# EAGLE design 4ButtonSwitch.Rev4.0 (EAGLE 8.6.0)
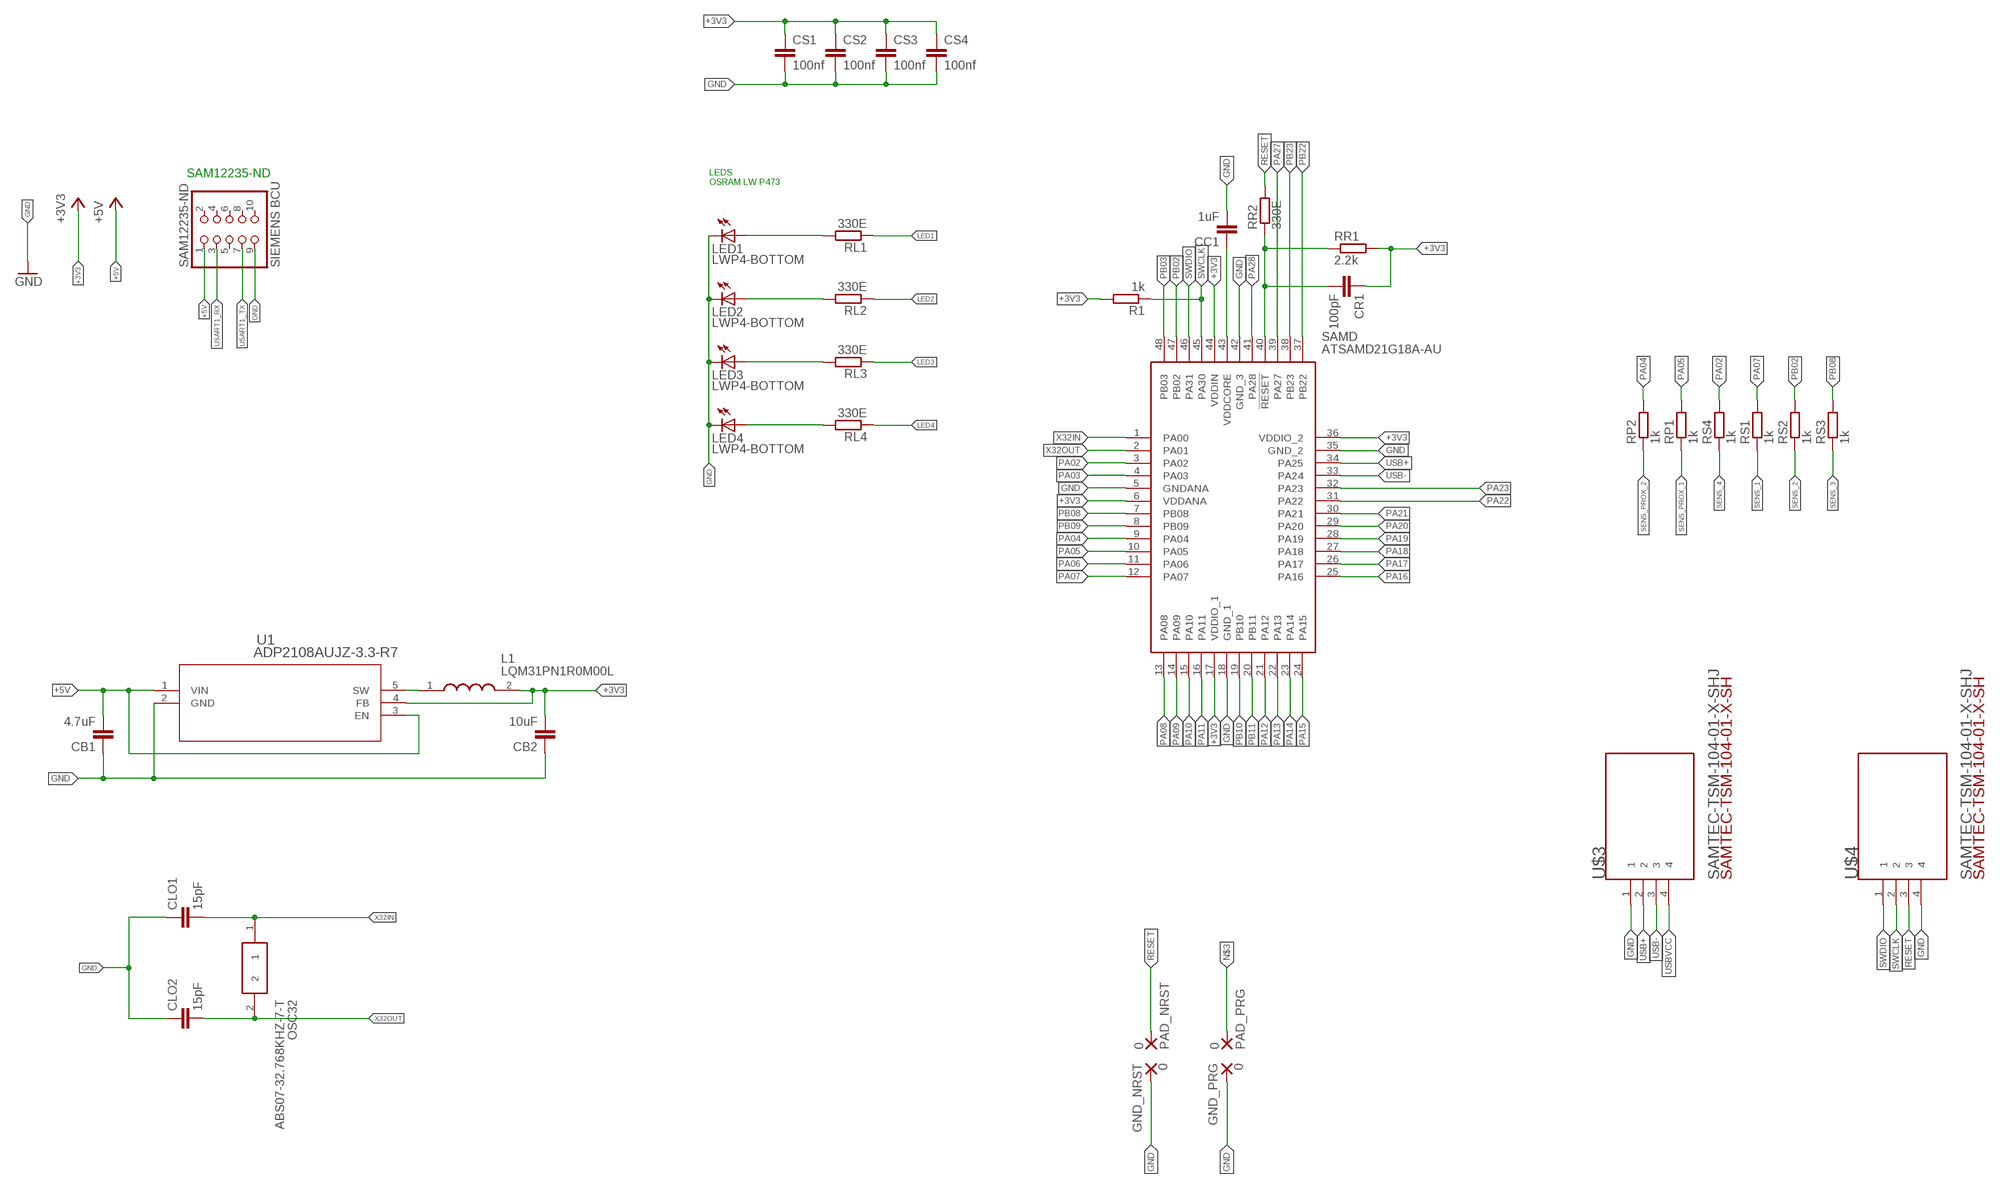
[diagram p0: schematic, sheet 1]

## Parts
CB1  4.7uF  C-EUC1206  [C1206]
CB2  10uF  C-EUC1206  [C1206]
CC1  1uF  C-EUC1206  [C1206]
CLO1  15pF  C-EUC1206  [C1206]
CLO2  15pF  C-EUC1206  [C1206]
CR1  100pF  C-EUC1206  [C1206]
CS1  100nf  C-EUC1206  [C1206]
CS2  100nf  C-EUC1206  [C1206]
CS3  100nf  C-EUC1206  [C1206]
CS4  100nf  C-EUC1206  [C1206]
GND_NRST  0  SMD5  [SMD2,54-5,08]
GND_PRG  0  SMD5  [SMD2,54-5,08]
L1  LQM31PN1R0M00L  [INDC3216X95N]
LED1  LWP4-BOTTOM  [P47F-BOTTOM]
LED2  LWP4-BOTTOM  [P47F-BOTTOM]
LED3  LWP4-BOTTOM  [P47F-BOTTOM]
LED4  LWP4-BOTTOM  [P47F-BOTTOM]
OSC32  ABS07-32.768KHZ-7-T  [ABS-07]
PAD_NRST  0  SMD5  [SMD2,54-5,08]
PAD_PRG  0  SMD5  [SMD2,54-5,08]
R1  1k  R-EU_R1206  [R1206]
RL1  330E  R-EU_R1206  [R1206]
RL2  330E  R-EU_R1206  [R1206]
RL3  330E  R-EU_R1206  [R1206]
RL4  330E  R-EU_R1206  [R1206]
RP1  1k  R-EU_R1206  [R1206]
RP2  1k  R-EU_R1206  [R1206]
RR1  2.2k  R-EU_R1206  [R1206]
RR2  330E  R-EU_R1206  [R1206]
RS1  1k  R-EU_R1206  [R1206]
RS2  1k  R-EU_R1206  [R1206]
RS3  1k  R-EU_R1206  [R1206]
RS4  1k  R-EU_R1206  [R1206]
SAM12235-ND  SIEMENS BCU  PINHD-2X5_2.54-SMD  [2X05SMD]
SAMD  ATSAMD21G18A-AU  [QFP50P900X900X120-48N]
U1  ADP2108AUJZ-3.3-R7  [UJ_5]
U$3  SAMTEC-TSM-104-01-X-SHJ  [SAMTEC-TSM-104-01-X-SH]
U$4  SAMTEC-TSM-104-01-X-SHJ  [SAMTEC-TSM-104-01-X-SH]

## Nets
+3V3: CB2.2 CR1.1 CS1.1 CS2.1 CS3.1 CS4.1 L1.2 R1.2 RR1.2 SAMD.6(VDDANA) SAMD.17(VDDIO_1) SAMD.36(VDDIO_2) SAMD.44(VDDIN) U1.4(FB)
+5V: CB1.2 SAM12235-ND.1 U1.1(VIN) U1.3(EN)
GND: CB1.1 CB2.1 CC1.2 CLO1.1 CLO2.1 CS1.2 CS2.2 CS3.2 CS4.2 GND_NRST.1(P) GND_PRG.1(P) LED1.C LED2.C LED3.C LED4.C SAM12235-ND.9 SAMD.5(GNDANA) SAMD.18(GND_1) SAMD.35(GND_2) SAMD.42(GND_3) U1.2(GND) U$3.1 U$4.4
LED1: RL1.1
LED2: RL2.1
LED3: RL3.1
LED4: RL4.1
N$2: L1.1 U1.5(SW)
N$3: PAD_PRG.1(P)
N$19: LED1.A RL1.2
N$20: LED2.A RL2.2
N$21: LED3.A RL3.2
N$22: LED4.A RL4.2
NRST: CR1.2 RR1.1 RR2.1 SAMD.40(!RESET)
PA02: RS4.2 SAMD.3(PA02)
PA03: SAMD.4(PA03)
PA04: RP2.2 SAMD.9(PA04)
PA05: RP1.2 SAMD.10(PA05)
PA06: SAMD.11(PA06)
PA07: RS1.2 SAMD.12(PA07)
PA08: SAMD.13(PA08)
PA09: SAMD.14(PA09)
PA10: SAMD.15(PA10)
PA11: SAMD.16(PA11)
PA12: SAMD.21(PA12)
PA13: SAMD.22(PA13)
PA14: SAMD.23(PA14)
PA15: SAMD.24(PA15)
PA16: SAMD.25(PA16)
PA17: SAMD.26(PA17)
PA18: SAMD.27(PA18)
PA19: SAMD.28(PA19)
PA20: SAMD.29(PA20)
PA21: SAMD.30(PA21)
PA22: SAMD.31(PA22)
PA23: SAMD.32(PA23)
PA27: SAMD.39(PA27)
PA28: SAMD.41(PA28)
PB02: RS2.2 SAMD.47(PB02)
PB03: SAMD.48(PB03)
PB08: RS3.2 SAMD.7(PB08)
PB09: SAMD.8(PB09)
PB10: SAMD.19(PB10)
PB11: SAMD.20(PB11)
PB22: SAMD.37(PB22)
PB23: SAMD.38(PB23)
RESET: PAD_NRST.1(P) RR2.2 U$4.3
SENS_1: RS1.1
SENS_2: RS2.1
SENS_3: RS3.1
SENS_4: RS4.1
SENS_PROX_1: RP1.1
SENS_PROX_2: RP2.1
SWCLK: R1.1 SAMD.45(PA30) U$4.2
SWDIO: SAMD.46(PA31) U$4.1
USART1_RX: SAM12235-ND.3
USART1_TX: SAM12235-ND.7
USB+: SAMD.34(PA25) U$3.2
USB-: SAMD.33(PA24) U$3.3
USBVCC: U$3.4
VDDCORE: CC1.1 SAMD.43(VDDCORE)
X32IN: CLO1.2 OSC32.1 SAMD.1(PA00)
X32OUT: CLO2.2 OSC32.2 SAMD.2(PA01)
Unconnected: SAM12235-ND.2 SAM12235-ND.4 SAM12235-ND.5 SAM12235-ND.6 SAM12235-ND.8 SAM12235-ND.10

## Notes on the sheet
- SAM12235-ND
- LEDS
  OSRAM LW P473

## Library data of the parts
CB1 CB2 CC1 CLO1 CLO2 CR1 CS1-CS4 = rcl:C-EU: CAPACITOR, European symbol; SPICEPREFIX: C
GND_NRST GND_PRG PAD_NRST PAD_PRG = wirepad:SMD5: SMD PAD
L1 = LQM31PN1R0M00L:LQM31PN1R0M00L: Murata LQM31P_00 Series 1000 nH 20% Ferrite Multilayer SMD Inductor, 1206 Case, SRF: 0.06GHz 1200mA dc 150m Rdc Source: Datasheet <http://docs-europe.electrocomponents.com/webdocs/1256/0900766b812561f7.pdf>; ARROW_PART_NUMBER: LQM31PN1R0M00L; ARROW_PRICE-STOCK: http://uk.rs-online.com/web/p/products/1674189; DESCRIPTION: Murata LQM31P_00 Series 1000 nH 20% Ferrite Multilayer SMD Inductor, 1206 Case, SRF: 0.06GHz 1200mA dc 150m Rdc; HEIGHT: 0.95mm; MANUFACTURER_NAME: Murata Electronics; MANUFACTURER_PART_NUMBER: LQM31PN1R0M00L; RS_PART_NUMBER: 1674189; RS_PRICE-STOCK: http://uk.rs-online.com/web/p/products/1674189
LED1-LED4 = led:*P4: PointLED® Enhanced Thinfilm LED TOP & BOTTOM mount LS P47F, LR P47F, LA P47F, LY P47F, LT P4SG, LB P4SG, LW P4SG Source: http://catalog.osram-os.com .. LA_LR_LS_LY_P47F_Pb_free.pdf
OSC32 = ABS07-32.768KHZ-7-T:ABS07-32.768KHZ-7-T: ABRACON - ABS07-32.768KHZ-7-T - CRYSTAL, 32.768KHZ, 7PF, SMD Source: Datasheet <https://componentsearchengine.com/Datasheets/2/ABS07-32.768KHZ-7-T.pdf>; ARROW_PART_NUMBER: ABS07-32.768KHZ-7-T; ARROW_PRICE/STOCK: https://www.arrow.com/en/products/abs07-32.768khz-7-t/abracon; DESCRIPTION: ABRACON - ABS07-32.768KHZ-7-T - CRYSTAL, 32.768KHZ, 7PF, SMD; HEIGHT: mm; MANUFACTURER_NAME: ABRACON; MANUFACTURER_PART_NUMBER: ABS07-32.768KHZ-7-T; RS_PART_NUMBER: 1712773P; RS_PRICE/STOCK: http://uk.rs-online.com/web/p/products/1712773P
R1 RL1-RL4 RP1 RP2 RR1 RR2 RS1-RS4 = resistor:R-EU_: RESISTOR, European symbol
SAM12235-ND = pinhead:PINHD-2X5: PIN HEADER
SAMD = ATSAMD21G18A-AU:ATSAMD21G18A-AU: ATMEL - ATSAMD21G18A-AU - MCU, 32BIT, CORTEX-M0+, 48MHZ, TQFP-48 Source: Datasheet <http://www.farnell.com/datasheets/1807566.pdf>; ARROW_PART_NUMBER: ATSAMD21G18A-AU; ARROW_PRICE-STOCK: https://www.arrow.com/en/products/atsamd21g18a-au/microchip-technology; DESCRIPTION: ATMEL - ATSAMD21G18A-AU - MCU, 32BIT, CORTEX-M0+, 48MHZ, TQFP-48; HEIGHT: 1.2mm; MANUFACTURER_NAME: Microchip; MANUFACTURER_PART_NUMBER: ATSAMD21G18A-AU; RS_PART_NUMBER: 1773799P; RS_PRICE-STOCK: http://uk.rs-online.com/web/p/products/1773799P
U1 = ADP2108AUJZ-3.3-R7CT-ND:ADP2108AUJZ-3.3-R7; MANUFACTURER_PART_NUMBER: ADP2108AUJZ3.3R7; VENDOR: Analog Devices Inc
U$3 U$4 = SAMTEC-TSM-104-01-X-SH:SAMTEC-TSM-104-01-X-SH; AVAILABILITY: Good; DESCRIPTION: HEADER, 2.54MM, SMT, 4POS; Series: TSM; Pitch Spacing: 2.54mm; No. of Rows: 1; No.; MF: Samtec; MP: TSM-104-01-T-SH; PACKAGE: None; PRICE: 0.31 USD

## Board
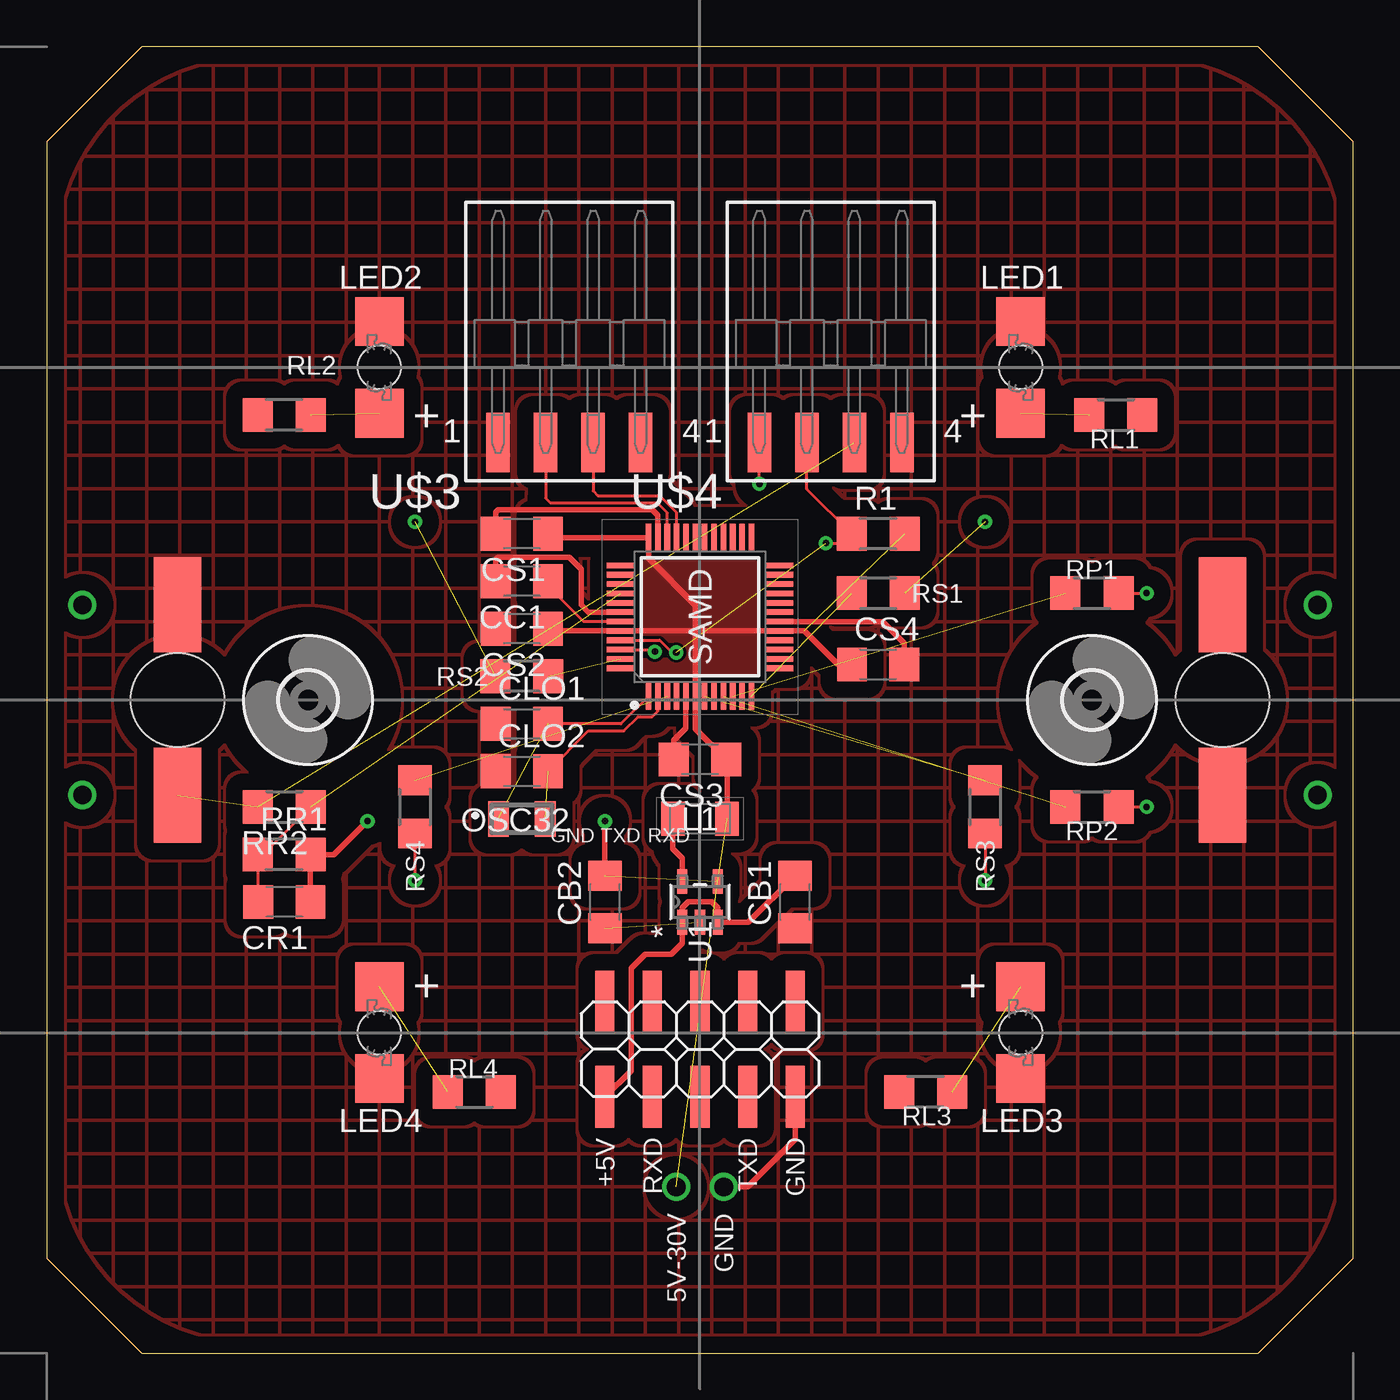
[diagram p1: board, top side]
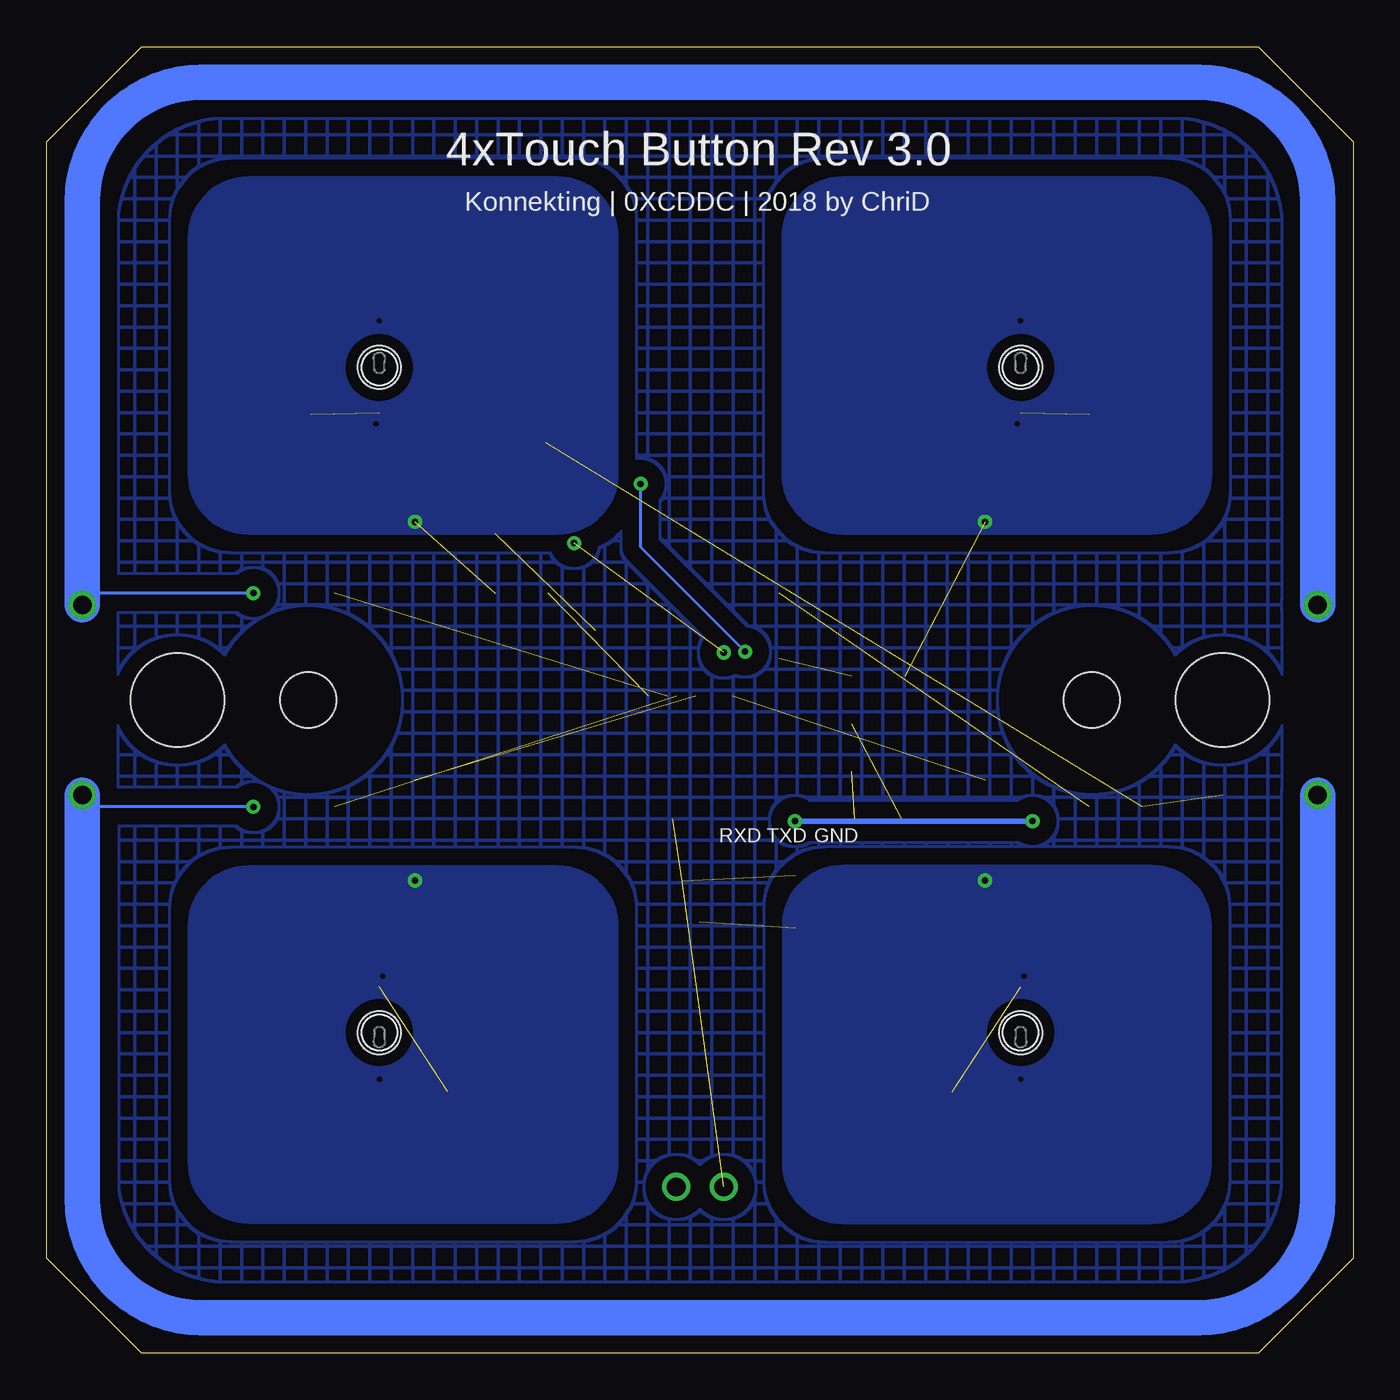
[diagram p2: board, bottom side, seen from below]

Size 69.85 x 69.85 mm. Coordinates in mm from the lower left corner, seen from the top.
Outline: 5.08,69.85 64.77,69.85 69.85,64.77 69.85,5.08 64.77,0 5.08,0 0,5.08 0,64.77 5.08,69.85
Outline: 6.34,69.84 5.08,69.85
Copper layers (1*2*15*16): Top 0.035mm / dielectric 0.23mm / Route2 0.035mm / dielectric 0.93mm / Route15 0.035mm / dielectric 0.23mm / Bottom 0.035mm
Design rules "konnektduino *": minimum track width 6mil, minimum drill 0.35mm, track to track 6mil, track to pad 6mil, pad to pad 6mil, via to via 6mil, smd to smd 6mil, copper to edge 25mil, drill to drill 6mil, minimum pad ring 10mil, minimum via ring 8mil, stop-mask expansion 1mil, vias tented up to drill 25mil, thermal gap 10mil
Holes 5 mm at 62.87,34.92 6.99,34.92

### Footprints (pad centres in the part's own frame; a part is rotated, then mirrored left to right if it is on the bottom)
C1206 = smd 1.6 x 1.8: 1 -1.4,0; 2 1.4,0
SMD2,54-5,08 = smd 2.54 x 5.08: 1 0,0
INDC3216X95N = smd 1.25 x 1.8: 1 -1.45,0; 2 1.45,0
P47F-BOTTOM = smd 2.6 x 2.6: A -2.45,0; C 2.45,0 | hole 2.3: 0,0
ABS-07 = smd 1.1 x 1.9: 1 -1.25,0; 2 1.25,0
R1206 = smd 1.6 x 1.803: 1 -1.422,0; 2 1.422,0
2X05SMD = smd 1.016 x 3.302: 1 -1.27,-3.81; 2 -1.27,1.27; 3 1.27,-3.81; 4 1.27,1.27; 5 3.81,-3.81; 6 3.81,1.27; 7 6.35,-3.81; 8 6.35,1.27; 9 8.89,-3.81; 10 8.89,1.27
QFP50P900X900X120-48N = smd 1.475 x 0.3: 1 -4.238,2.75; 2 -4.238,2.25; 3 -4.238,1.75; 4 -4.238,1.25; 5 -4.238,0.75; 6 -4.238,0.25; 7 -4.238,-0.25; 8 -4.238,-0.75; 9 -4.238,-1.25; 10 -4.238,-1.75; 11 -4.238,-2.25; 12 -4.238,-2.75; 25 4.238,-2.75; 26 4.238,-2.25; 27 4.238,-1.75; 28 4.238,-1.25; 29 4.238,-0.75; 30 4.238,-0.25; 31 4.238,0.25; 32 4.238,0.75; 33 4.238,1.25; 34 4.238,1.75; 35 4.238,2.25; 36 4.238,2.75 | smd 0.3 x 1.475: 13 -2.75,-4.238; 14 -2.25,-4.238; 15 -1.75,-4.238; 16 -1.25,-4.238; 17 -0.75,-4.238; 18 -0.25,-4.238; 19 0.25,-4.238; 20 0.75,-4.238; 21 1.25,-4.238; 22 1.75,-4.238; 23 2.25,-4.238; 24 2.75,-4.238; 37 2.75,4.238; 38 2.25,4.238; 39 1.75,4.238; 40 1.25,4.238; 41 0.75,4.238; 42 0.25,4.238; 43 -0.25,4.238; 44 -0.75,4.238; 45 -1.25,4.238; 46 -1.75,4.238; 47 -2.25,4.238; 48 -2.75,4.238
UJ_5 = smd 1.321 x 0.559: 1 -1.092,0.95; 2 -1.092,0; 3 -1.092,-0.95; 4 1.092,-0.95; 5 1.092,0.95
3,0 = hole 3: 0,0
SAMTEC-TSM-104-01-X-SH = smd 1.27 x 3.18: 1 -3.81,-5.283; 2 -1.27,-5.283; 3 1.27,-5.283; 4 3.81,-5.283

### Placement (x,y rotation side)
CB1  40.01,24.13 90 top
CB2  29.84,24.13 90 top
CC1  25.4,41.27 180 top
CLO1  25.4,33.66 0 top
CLO2  25.4,31.11 0 top
CR1  12.7,24.13 180 top
CS1  25.4,43.81 180 top
CS2  25.4,38.73 180 top
CS3  34.92,31.75 180 top
CS4  44.45,36.83 0 top
GND_NRST  6.99,40.01 0 top
GND_PRG  62.87,29.84 0 top
L1  34.92,28.57 0 top
LED1  52.07,52.7 90 top
LED2  17.78,52.7 90 top
LED3  52.07,17.14 270 top
LED4  17.78,17.14 270 top
OSC32  25.4,28.57 0 top
PAD_NRST  6.99,29.84 0 top
PAD_PRG  62.87,40.01 0 top
R1  44.45,43.81 0 top
RL1  57.15,50.16 180 top
RL2  12.7,50.16 0 top
RL3  46.99,13.97 0 top
RL4  22.86,13.97 180 top
RP1  55.88,40.64 180 top
RP2  55.88,29.21 180 top
RR1  12.7,26.67 0 top
RR2  12.7,29.21 180 top
RS1  44.45,40.64 180 top
RS2  25.4,36.2 0 top
RS3  50.16,29.21 90 top
RS4  19.68,29.21 90 top
SAM12235-ND  31.11,17.53 0 top
SAMD  34.92,39.37 90 top
U1  34.92,24.13 90 top
U$1  [3,0]  13.97,34.92 0 top
U$2  [3,0]  55.88,34.92 0 top
U$3  27.94,53.98 0 top
U$4  41.91,53.98 0 top

### Tracks (layer width: path | path; a pad name or v marks a point on that pad's centre or on a via)
+3V3  (via drill 0.35, 1)  (4 unrouted)
  Top 0.305: L1.2 36.38,31.7 CS3.1 34.67,33.4 SAMD.6 34.67,38.62 | 34.67,38.62 SAMD.44 26.91,38.62 CS2.1 | 34.67,38.62 SAMD.17 40.5,38.62 42.29,36.83 CS4.1 | 34.67,38.62 | 34.67,38.62 34.67,40 32.17,42.5 SAMD.36 27.01,43.61 CS1.1 | CR1.1 14.1,26.65 | 14.1,26.65 RR1.2 | CB2.2 v29.84,28.45 | v17.14,28.45 15.35,26.65 14.1,26.65
  Bottom 0.305: v29.84,28.45 v17.14,28.45
  other vias: 33.66,8.89
  pour Top: 32,42.29 37.85,42.29 37.85,36.45 32,36.45
+5V
  Top 0.305: CB1.2 37.51,23.04 U1.3 35.88,23.82 35.56,24.13 34.29,24.13 33.98,23.82 U1.1 33.98,21.91 33.4,21.34 32,21.34 31.24,20.57 31.24,15.11 SAM12235-ND.1
GND  (via drill 1)  (1 unrouted)
  Top 0.305: 40.01,13.34 SAM12235-ND.9 40.01,11.43 37.47,8.89 v36.2,8.89 | SAMD.5 34.17,33.41 33.52,32.76 CS3.2 | SAMD.18 44.7,39.12 45.85,37.97 CS4.2 | SAMD.35 32.67,44.8 32.38,45.09 24.13,45.09 24,44.95 CS1.2 | SAMD.42 30.48,39.62 28.96,39.62 28.57,40.01 28.57,41.91 27.94,42.55 24.13,42.55 24,42.41 CC1.2
  pour Top (isolate 0.889, rank 6, no thermals, hatched): 0.64,10.79 arc90 10.79,0.64 59.05,0.64 arc90 69.22,10.79 69.22,59.05 arc90 59.05,69.22 10.79,69.22 arc90 0.64,59.05
N$2
  Top 0.305: U1.5 33.98,26.48 33.48,26.98 L1.1
N$19  (1 unrouted)
N$20  (1 unrouted)
N$21  (1 unrouted)
N$22  (1 unrouted)
NRST  (1 unrouted)
  Top 0.152: RR2.1 11.58,26.67 RR1.1 11.28,24.15 CR1.2
PA02  (1 unrouted)
PA04  (1 unrouted)
PA05  (1 unrouted)
PA07  (1 unrouted)
PB02  (1 unrouted)
PB08  (1 unrouted)
RESET  (2 unrouted)
SENS_1  (via drill 0.35)  (1 unrouted)
  other vias: 50.16,44.45
  pour Bottom: 39.37,59.69 39.37,46.99 arc90 42.55,43.81 59.05,43.81 arc90 62.23,46.99 62.23,59.69 arc90 59.05,62.87 42.55,62.87 arc90
SENS_2  (via drill 0.35)  (1 unrouted)
  other vias: 19.68,44.45
  pour Bottom: 10.79,43.81 27.3,43.81 arc90 30.48,46.99 30.48,59.69 arc90 27.3,62.87 10.79,62.87 arc90 7.62,59.69 7.62,46.99 arc90
SENS_3  (via drill 0.35)
  Top 0.152: RS3.1 v50.16,25.27
  pour Bottom: 59.05,26.04 42.55,26.04 arc90 39.37,22.86 39.37,10.16 arc90 42.55,6.99 59.05,6.99 arc90 62.23,10.16 62.23,22.86 arc90
SENS_4  (via drill 0.35)
  Top 0.152: RS4.1 v19.68,25.27
  pour Bottom: 7.62,10.16 7.62,22.86 arc-90 10.79,26.04 27.3,26.04 arc-90 30.48,22.86 30.48,10.16 arc-90 27.3,6.99 10.79,6.99 arc-90
SENS_PROX_1  (via drill 0.35, 1)
  Top 0.152: RP1.1 v58.8,40.64
  Bottom 0.152: v58.8,40.64 67.31,40.64 v67.94,40.01
  Bottom 1.905: v1.91,40.01 1.91,61.59 arc-90 8.26,67.94 61.59,67.94 arc-90 67.94,61.59 v67.94,40.01
SENS_PROX_2  (via drill 0.35, 1)
  Top 0.152: RP2.1 v58.8,29.21
  Bottom 0.152: v58.8,29.21 67.31,29.21 v67.94,29.84
  Bottom 1.905: v1.91,29.84 1.91,8.26 arc90 8.26,1.91 61.59,1.91 arc90 67.94,8.26 v67.94,29.84
SHIELD_OR_GND
  pour Bottom (isolate 0.889, rank 6, no thermals, hatched): 3.81,9.53 arc90 9.53,3.81 60.33,3.81 arc90 66.04,9.53 66.04,60.33 arc90 60.33,66.04 9.53,66.04 arc90 3.81,60.33
SWCLK  (via drill 0.35)  (1 unrouted)
  Top 0.152: v33.66,37.47 33.42,37.47 32.76,38.12 SAMD.45 | 43.03,43.03 43.03,43.69 | 43.03,43.69 R1.1 40.64,46.2 U$4.2 | v41.66,43.31 42.65,43.31 43.03,43.69
SWDIO  (via drill 0.35)
  Top 0.152: SAMD.46 32.41,37.62 v32.51,37.51 | v38.1,46.48 U$4.1
  Bottom 0.152: v32.51,37.51 38.1,43.1 v38.1,46.48
USB+
  Top 0.152: SAMD.34 33.17,44.93 32.64,45.47 26.92,45.47 26.67,45.72 U$3.2
USB-
  Top 0.152: SAMD.33 33.67,44.94 32.77,45.85 29.46,45.85 29.21,46.1 U$3.3
VDDCORE
  Top 0.152: SAMD.43 28.7,39.12 26.8,41.02 CC1.1
X32IN  (1 unrouted)
  Top 0.152: SAMD.1 30.7,33.66 CLO1.2
X32OUT  (1 unrouted)
  Top 0.152: CLO2.2 28.96,33.27 30.86,33.27 31.62,34.04 32.38,34.04 32.67,34.33 SAMD.2

### Text on the board
tNames: + | + | GND | TXD | RXD | + | + | +5V | RXD | TXD | GND | 5V-30V | GND
bNames: 4xTouch Button Rev 3.0 | Konnekting | 0XCDDC | 2018 by ChriD | GND | TXD | RXD